# Altium schematic sheet BatteryManagement.SchDoc
size A4; SheetNumber: 5; SheetTotal: 13
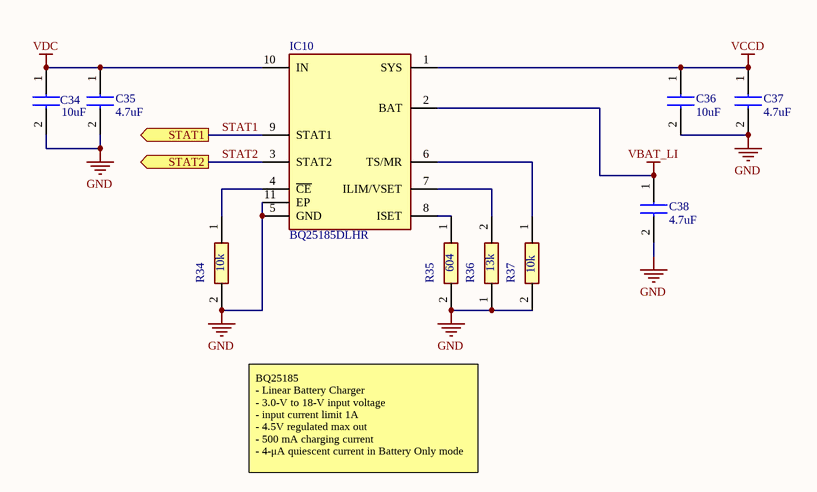
[diagram p0: BatteryManagement.SchDoc]

## Parts
C34  10uF  [GRM18x]
C35  4.7uF  [CAPC1608X90N]
C36  10uF  [GRM18x]
C37  4.7uF  [CAPC1608X90N]
C38  4.7uF  [CAPC1608X90N]
IC10  BQ25185DLHR  [SON40P220X200X80-11N]
R34  10k  [RESC1005X35N]
R35  604  [RESC1005X35N]
R36  13k  [RESC1005X35N]
R37  10k  [RESC1005X35N]

## Ports
STAT1 (out, see Power[2B]), STAT2 (out, see Power[2B])

## Nets
GND: C34.2 C35.2 C36.2 C37.2 C38.2 IC10.5(GND) IC10.11(EP) R34.2 R35.2 R36.1 R37.2
VBAT_LI: C38.1 IC10.2(BAT)
VCCD: C36.1 C37.1 IC10.1(SYS)
VDC: C34.1 C35.1 IC10.10(IN)
STAT1: IC10.9(STAT1) ; port STAT1
STAT2: IC10.3(STAT2) ; port STAT2
NetIC10_4: IC10.4(~{CE}) R34.1
NetIC10_6: IC10.6(TS/MR) R37.1
NetIC10_7: IC10.7(ILIM/VSET) R36.2
NetIC10_8: IC10.8(ISET) R35.1

## Notes on the sheet
- BQ25185
  - Linear Battery Charger
  - 3.0-V to 18-V input voltage
  - input current limit 1A
  - 4.5V regulated max out
  - 500 mA charging current
  - 4-μA quiescent current in Battery Only mode
- Title:
- Date:
- Project:
- Type:
- Schematic
- Variant:
- Revision:
- Sheet
- of
- Author:
- Evžen Šteif
- Size:
- A4

## Library data of the parts
C34 C36 = GRM188R61E106KA73D: Capacitor; Manufacturer_Name: Murata Electronics; Datasheet Link: https://search.murata.co.jp/Ceramy/image/img/A01X/G101/ENG/GRM188R61E106KA73-01A.pdf; Height: 0.9mm; Manufacturer_Part_Number: GRM188R61E106KA73D; Mouser Part Number: 81-GRM188R61E106KA3D; Mouser Price/Stock: https://www.mouser.co.uk/ProductDetail/Murata-Electronics/GRM188R61E106KA73D?qs=5aG0NVq1C4z8ebxPkQZf9A%3D%3D; Arrow Part Number: GRM188R61E106KA73D; Arrow Price/Stock: https://www.arrow.com/en/products/grm188r61e106ka73d/murata-manufacturing?region=nac
C35 C37 C38 = GRM188R61E475KE11J: Capacitor; Manufacturer_Name: Murata Electronics; Datasheet Link: https://search.murata.co.jp/Ceramy/image/img/A01X/G101/ENG/GRM188R61E475KE11-01A.pdf; Height: 0.9mm; Manufacturer_Part_Number: GRM188R61E475KE11J; Mouser Part Number: 81-GRM188R61E475KE1J; Mouser Price/Stock: https://www.mouser.co.uk/ProductDetail/Murata-Electronics/GRM188R61E475KE11J?qs=hNud%2FORuBR3%2Fa9GLJFT8KA%3D%3D; Arrow Part Number: GRM188R61E475KE11J; Arrow Price/Stock: https://www.arrow.com/en/products/grm188r61e475ke11j/murata-manufacturing
IC10 = BQ25185DLHR: Integrated Circuit; Manufacturer_Name: Texas Instruments; Datasheet Link: https://www.ti.com/lit/ds/symlink/bq25185.pdf?ts=1706857561339&ref_url=https%253A%252F%252Fwww.ti.com%252Fproduct%252FBQ25185; Height: 0.8mm; Manufacturer_Part_Number: BQ25185DLHR; Mouser Part Number: 595-BQ25185DLHR; Mouser Price/Stock: https://www.mouser.co.uk/ProductDetail/Texas-Instruments/BQ25185DLHR?qs=Z%252BL2brAPG1IbO%2FV3RqsaPw%3D%3D
R34 R37 = RT0402FRE0710KL: Resistor; Manufacturer_Name: KEMET; Datasheet Link: https://cz.mouser.com/datasheet/2/447/PYu_RT_1_to_0_01_RoHS_L_15-3461507.pdf; Height: 0.35mm; Manufacturer_Part_Number: RT0402FRE0710KL; Mouser Part Number: 603-RT0402FRE0710KL; Mouser Price/Stock: https://www.mouser.co.uk/ProductDetail/YAGEO/RT0402FRE07100KL?qs=BXCcY9r%252B08CxTvf5JB1kiw%3D%3D; Arrow Part Number: RT0402FRE07100KL; Arrow Price/Stock: https://www.arrow.com/en/products/rt0402fre07100kl/yageo
R35 = RT0402BRD07604RL: Resistor; Manufacturer_Name: KEMET; Datasheet Link: https://cz.mouser.com/datasheet/2/447/PYu_RT_1_to_0_01_RoHS_L_15-3461507.pdf; Height: 0.35mm; Manufacturer_Part_Number: RT0402BRD07604RL; Mouser Part Number: 603-RT0402BRD0713KL; Mouser Price/Stock: https://www.mouser.com/Search/Refine.aspx?Keyword=603-RT0402BRD0713KL; Arrow Part Number: RT0402BRD0713KL; Arrow Price/Stock: https://www.arrow.com/en/products/rt0402brd0713kl/yageo
R36 = RT0402BRD0713KL: Resistor; Manufacturer_Name: KEMET; Datasheet Link: https://www.yageo.com/upload/media/product/productsearch/datasheet/rchip/PYu-RT_1-to-0.01_RoHS_L_12.pdf; Height: 0.35mm; Manufacturer_Part_Number: RT0402BRD0713KL; Mouser Part Number: 603-RT0402BRD0713KL; Mouser Price/Stock: https://www.mouser.com/Search/Refine.aspx?Keyword=603-RT0402BRD0713KL; Arrow Part Number: RT0402BRD0713KL; Arrow Price/Stock: https://www.arrow.com/en/products/rt0402brd0713kl/yageo